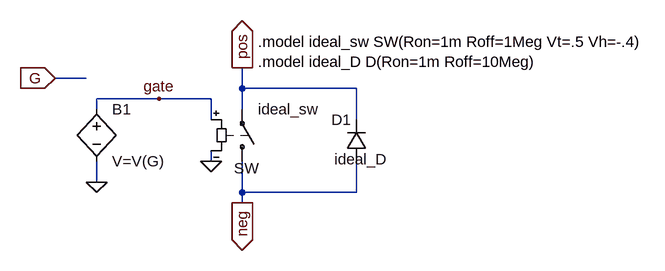
[diagram p0: schematic idealsw.asc]
idealsw.asc, the LTspice schematic file:
Version 4
SHEET 1 880 680
WIRE -48 32 -96 32
WIRE 192 48 192 16
WIRE 368 48 192 48
WIRE 64 64 -32 64
WIRE 144 64 64 64
WIRE -32 80 -32 64
WIRE 192 80 192 48
WIRE 144 96 144 64
WIRE 368 96 368 48
WIRE 144 160 144 144
WIRE -32 192 -32 160
WIRE 192 208 192 160
WIRE 368 208 368 160
WIRE 368 208 192 208
WIRE 192 224 192 208
FLAG 144 160 0
FLAG -32 192 0
FLAG -96 32 G
IOPIN -96 32 In
FLAG 64 64 gate
FLAG 192 16 pos
IOPIN 192 16 Out
FLAG 192 224 neg
IOPIN 192 224 Out
SYMBOL sw 192 176 M180
WINDOW 0 -13 5 Left 2
SYMATTR InstName SW
SYMATTR Value ideal_sw
SYMBOL diode 384 160 R180
WINDOW 0 24 64 Left 2
WINDOW 3 -32 3 Left 2
SYMATTR InstName D1
SYMATTR Value ideal_D
SYMBOL bv -32 64 R0
SYMATTR InstName B1
SYMATTR Value V=V(G)
TEXT 216 -24 Left 2 !.model ideal_sw SW(Ron=1m Roff=1Meg Vt=.5 Vh=-.4)\n.model ideal_D D(Ron=1m Roff=10Meg)

The netlist it stands for:
* idealsw.asc
SW neg pos gate 0 ideal_sw
D1 neg pos ideal_D
B1 gate 0 V=V(G)
.model D D
.lib standard.dio
.model ideal_sw SW(Ron=1m Roff=1Meg Vt=.5 Vh=-.4)
.model ideal_D D(Ron=1m Roff=10Meg)
.backanno
.end